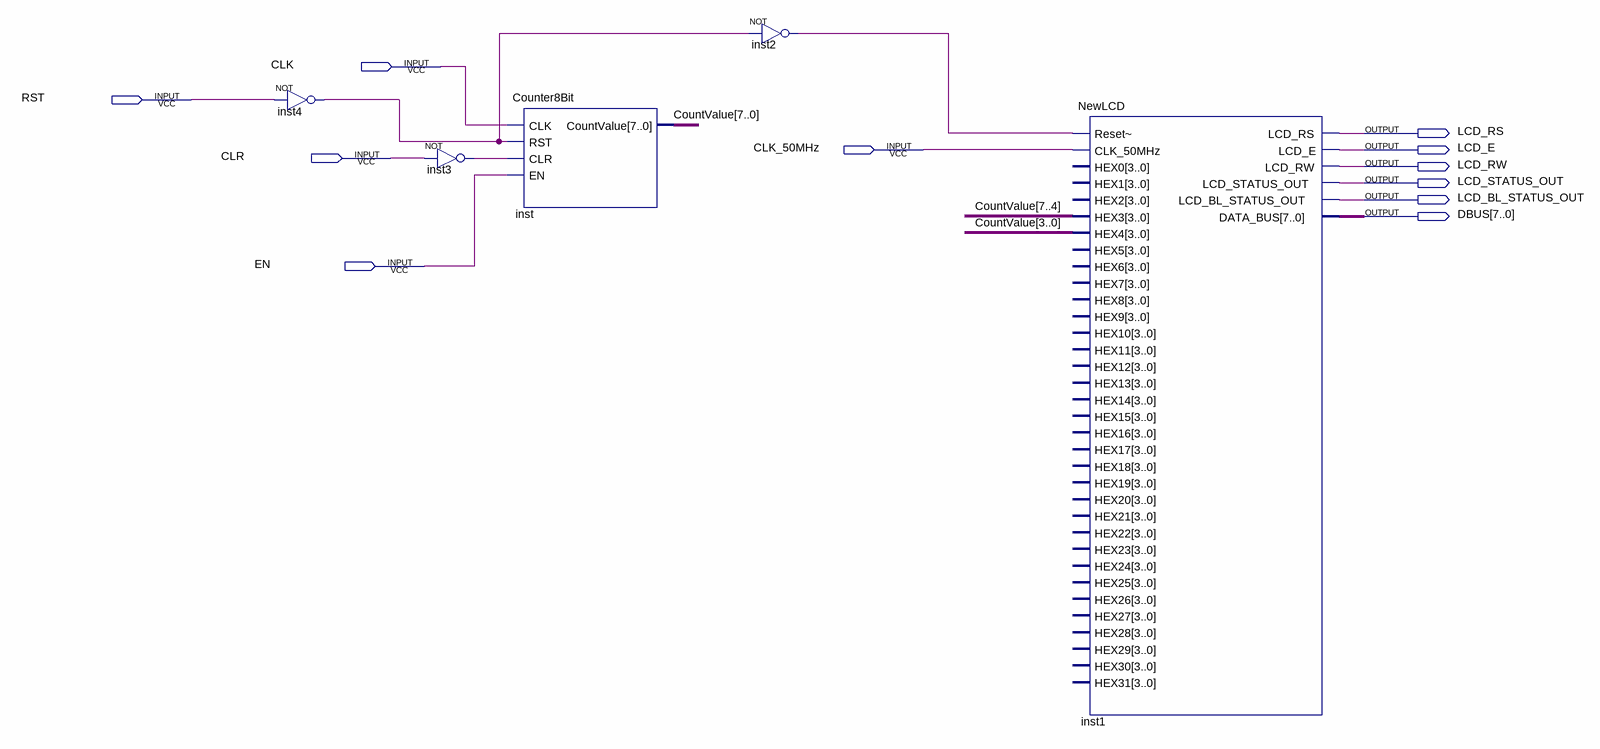
[diagram p0: schematic sheet]
// Quartus schematic lab4-counter_8bit.bdf as structural Verilog: 5 symbols, 11 pins
module \lab4-counter_8bit  (
  input  CLK,
  input  RST,
  input  CLK_50MHz,
  input  CLR,
  input  EN,
  output LCD_RS,
  output LCD_E,
  output LCD_RW,
  output LCD_STATUS_OUT,
  output LCD_BL_STATUS_OUT,
  output [7:0] DBUS
);

  wire inst2_out, inst3_out, inst4_out;
  wire [7:0] CountValue;

  not inst4 (inst4_out, RST);
  not inst3 (inst3_out, CLR);
  Counter8Bit inst (.CLK(CLK), .RST(inst4_out), .CLR(inst3_out), .EN(EN), .CountValue(CountValue));
  not inst2 (inst2_out, inst4_out);
  NewLCD inst1 (
    .\Reset~ (inst2_out), .CLK_50MHz(CLK_50MHz), .HEX3(CountValue[7:4]), .HEX4(CountValue[3:0]),
    .LCD_RS(LCD_RS), .LCD_E(LCD_E), .LCD_RW(LCD_RW), .LCD_STATUS_OUT(LCD_STATUS_OUT),
    .LCD_BL_STATUS_OUT(LCD_BL_STATUS_OUT), .DATA_BUS(DBUS));  // open: HEX0, HEX1, HEX2, HEX5, HEX6, HEX7, HEX8, HEX9, HEX10, HEX11, HEX12, HEX13, HEX14, HEX15, HEX16, HEX17, HEX18, HEX19, HEX20, HEX21, HEX22, HEX23, HEX24, HEX25, HEX26, HEX27, HEX28, HEX29, HEX30, HEX31
endmodule
